# EAGLE schematic HUD (EAGLE 7.3.0)
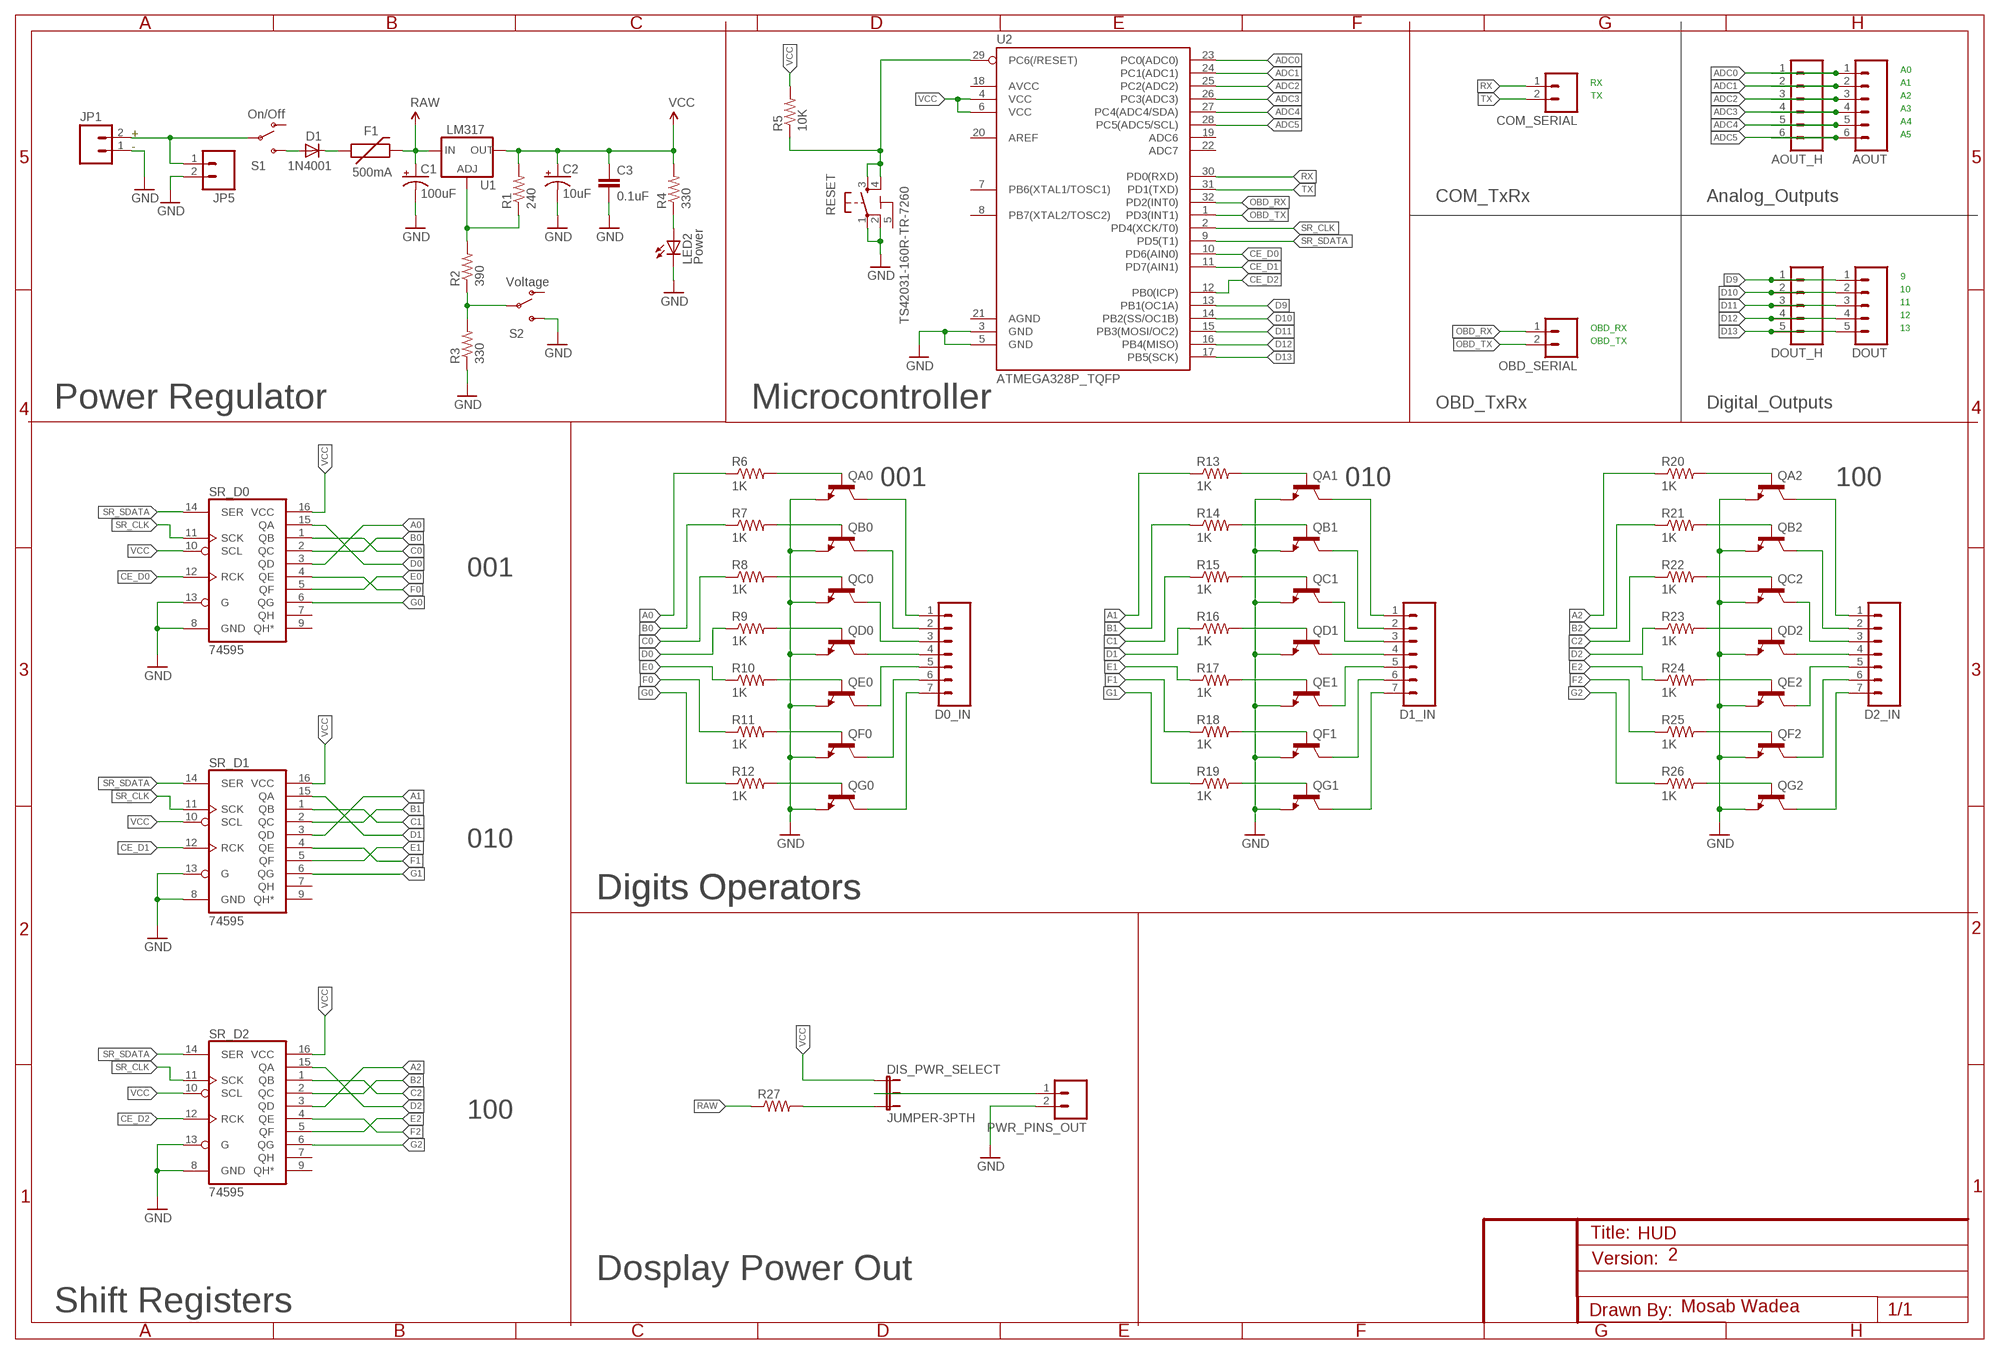
[diagram p0: schematic, sheet 1]

## Parts
AOUT  M06SILK_FEMALE_PTH  [1X06]
AOUT_H  M06SILK_FEMALE_PTH  [1X06]
C1  100uF  CAP_POLPTH1  [CPOL-RADIAL-100UF-25V]
C2  10uF  CAP_POLPTH2  [CPOL-RADIAL-10UF-25V]
C3  0.1uF  CAPPTH2  [CAP-PTH-SMALL2]
COM_SERIAL  M02PTH  [1X02]
D0_IN  M07  [1X07]
D1  1N4001  DIODEPTH  [DIODE-0.4]
D1_IN  M07  [1X07]
D2_IN  M07  [1X07]
DIS_PWR_SELECT  JUMPER-3PTH  [1X03]
DOUT  M05PTH  [1X05]
DOUT_H  M05PTH  [1X05]
F1  500mA  PTCPTH  [PTC]
JP1  M02PTH  [1X02]
JP5  M02PTH  [1X02]
LED2  Power  LED5MM  [LED5MM]
OBD_SERIAL  M02PTH  [1X02]
PWR_PINS_OUT  M02PTH  [1X02]
QA0  TRANSISTOR_NPNP2N2222A  [TO-92]
QA1  TRANSISTOR_NPNP2N2222A  [TO-92]
QA2  TRANSISTOR_NPNP2N2222A  [TO-92]
QB0  TRANSISTOR_NPNP2N2222A  [TO-92]
QB1  TRANSISTOR_NPNP2N2222A  [TO-92]
QB2  TRANSISTOR_NPNP2N2222A  [TO-92]
QC0  TRANSISTOR_NPNP2N2222A  [TO-92]
QC1  TRANSISTOR_NPNP2N2222A  [TO-92]
QC2  TRANSISTOR_NPNP2N2222A  [TO-92]
QD0  TRANSISTOR_NPNP2N2222A  [TO-92]
QD1  TRANSISTOR_NPNP2N2222A  [TO-92]
QD2  TRANSISTOR_NPNP2N2222A  [TO-92]
QE0  TRANSISTOR_NPNP2N2222A  [TO-92]
QE1  TRANSISTOR_NPNP2N2222A  [TO-92]
QE2  TRANSISTOR_NPNP2N2222A  [TO-92]
QF0  TRANSISTOR_NPNP2N2222A  [TO-92]
QF1  TRANSISTOR_NPNP2N2222A  [TO-92]
QF2  TRANSISTOR_NPNP2N2222A  [TO-92]
QG0  TRANSISTOR_NPNP2N2222A  [TO-92]
QG1  TRANSISTOR_NPNP2N2222A  [TO-92]
QG2  TRANSISTOR_NPNP2N2222A  [TO-92]
R1  240  RESISTORPTH1  [AXIAL-0.3]
R2  390  RESISTORPTH1  [AXIAL-0.3]
R3  330  RESISTORPTH1  [AXIAL-0.3]
R4  330  RESISTORPTH1  [AXIAL-0.3]
R5  10K  RESISTORPTH-1/4W  [AXIAL-0.4]
R6  1K  RESISTORPTH-1/4W  [AXIAL-0.4]
R7  1K  RESISTORPTH-1/4W  [AXIAL-0.4]
R8  1K  RESISTORPTH-1/4W  [AXIAL-0.4]
R9  1K  RESISTORPTH-1/4W  [AXIAL-0.4]
R10  1K  RESISTORPTH-1/4W  [AXIAL-0.4]
R11  1K  RESISTORPTH-1/4W  [AXIAL-0.4]
R12  1K  RESISTORPTH-1/4W  [AXIAL-0.4]
R13  1K  RESISTORPTH-1/4W  [AXIAL-0.4]
R14  1K  RESISTORPTH-1/4W  [AXIAL-0.4]
R15  1K  RESISTORPTH-1/4W  [AXIAL-0.4]
R16  1K  RESISTORPTH-1/4W  [AXIAL-0.4]
R17  1K  RESISTORPTH-1/4W  [AXIAL-0.4]
R18  1K  RESISTORPTH-1/4W  [AXIAL-0.4]
R19  1K  RESISTORPTH-1/4W  [AXIAL-0.4]
R20  1K  RESISTORPTH-1/4W  [AXIAL-0.4]
R21  1K  RESISTORPTH-1/4W  [AXIAL-0.4]
R22  1K  RESISTORPTH-1/4W  [AXIAL-0.4]
R23  1K  RESISTORPTH-1/4W  [AXIAL-0.4]
R24  1K  RESISTORPTH-1/4W  [AXIAL-0.4]
R25  1K  RESISTORPTH-1/4W  [AXIAL-0.4]
R26  1K  RESISTORPTH-1/4W  [AXIAL-0.4]
R27  RESISTORPTH-1/4W  [AXIAL-0.4]
RESET  TS42031-160R-TR-7260  TS42  [TS42]
S1  On/Off  SWITCH-SPSTPTH  [SWITCH-SPST]
S2  Voltage  SWITCH-SPSTPTH  [SWITCH-SPST]
SR_D0  74595  [TSSOP16]
SR_D1  74595  [TSSOP16]
SR_D2  74595  [TSSOP16]
U1  LM317  V_REG_317SINK  [TO220-ADJ]
U2  ATMEGA328P_TQFP  [TQFP32-08]

## Nets
12VOUT: DIS_PWR_SELECT.3 R27.P$2
A0: R6.P$1 SR_D0.3(QD)
A1: R13.P$1 SR_D1.3(QD)
A2: R20.P$1 SR_D2.3(QD)
ADC0: AOUT.1 AOUT_H.1 U2.23(PC0(ADC0))
ADC1: AOUT.2 AOUT_H.2 U2.24(PC1(ADC1))
ADC2: AOUT.3 AOUT_H.3 U2.25(PC2(ADC2))
ADC3: AOUT.4 AOUT_H.4 U2.26(PC3(ADC3))
ADC4: AOUT.5 AOUT_H.5 U2.27(PC4(ADC4/SDA))
ADC5: AOUT.6 AOUT_H.6 U2.28(PC5(ADC5/SCL))
B0: R7.P$1 SR_D0.2(QC)
B1: R14.P$1 SR_D1.2(QC)
B2: R21.P$1 SR_D2.2(QC)
C0: R8.P$1 SR_D0.1(QB)
C1: R15.P$1 SR_D1.1(QB)
C2: R22.P$1 SR_D2.1(QB)
CE_D0: SR_D0.12(RCK) U2.10(PD6(AIN0))
CE_D1: SR_D1.12(RCK) U2.11(PD7(AIN1))
CE_D2: SR_D2.12(RCK) U2.12(PB0(ICP))
D0: R9.P$1 SR_D0.15(QA)
D1: R16.P$1 SR_D1.15(QA)
D2: R23.P$1 SR_D2.15(QA)
D9: DOUT.1 DOUT_H.1 U2.13(PB1(OC1A))
D10: DOUT.2 DOUT_H.2 U2.14(PB2(SS/OC1B))
D11: DOUT.3 DOUT_H.3 U2.15(PB3(MOSI/OC2))
D12: DOUT.4 DOUT_H.4 U2.16(PB4(MISO))
D13: DOUT.5 DOUT_H.5 U2.17(PB5(SCK))
DISPLAY_PWR-OUT: DIS_PWR_SELECT.2 PWR_PINS_OUT.1
E0: R10.P$1 SR_D0.5(QF)
E1: R17.P$1 SR_D1.5(QF)
E2: R24.P$1 SR_D2.5(QF)
F0: R11.P$1 SR_D0.4(QE)
F1: R18.P$1 SR_D1.4(QE)
F2: R25.P$1 SR_D2.4(QE)
G0: R12.P$1 SR_D0.6(QG)
G1: R19.P$1 SR_D1.6(QG)
G2: R26.P$1 SR_D2.6(QG)
GND: C1.2(-) C2.2(-) C3.2 JP1.1 JP5.2 LED2.K(C) PWR_PINS_OUT.2 QA0.3(E) QA1.3(E) QA2.3(E) QB0.3(E) QB1.3(E) QB2.3(E) QC0.3(E) QC1.3(E) QC2.3(E) QD0.3(E) QD1.3(E) QD2.3(E) QE0.3(E) QE1.3(E) QE2.3(E) QF0.3(E) QF1.3(E) QF2.3(E) QG0.3(E) QG1.3(E) QG2.3(E) R3.P$1 RESET.1 RESET.2 S2.3(S) SR_D0.8(GND) SR_D0.13(G) SR_D1.8(GND) SR_D1.13(G) SR_D2.8(GND) SR_D2.13(G) U2.3(GND) U2.5(GND)
N$1: D1.C F1.P$1
N$2: D1.A S1.3(S)
N$4: R2.P$1 R3.P$2 S2.2(P)
N$5: R1.P$1 R2.P$2 U1.ADJ
N$6: QA0.2(B) R6.P$2
N$8: LED2.A R4.P$1
N$20: QA1.2(B) R13.P$2
N$21: QC1.2(B) R15.P$2
N$22: QD1.2(B) R16.P$2
N$23: QE1.2(B) R17.P$2
N$24: QF1.2(B) R18.P$2
N$25: QB1.2(B) R14.P$2
N$26: QG1.2(B) R19.P$2
N$27: D1_IN.4 QD1.1(C)
N$28: D1_IN.3 QC1.1(C)
N$29: D1_IN.2 QB1.1(C)
N$30: D1_IN.1 QA1.1(C)
N$31: D1_IN.5 QE1.1(C)
N$32: D1_IN.6 QF1.1(C)
N$33: D1_IN.7 QG1.1(C)
N$34: QC0.2(B) R8.P$2
N$35: QD0.2(B) R9.P$2
N$36: QE0.2(B) R10.P$2
N$37: QF0.2(B) R11.P$2
N$38: QB0.2(B) R7.P$2
N$39: QG0.2(B) R12.P$2
N$40: D0_IN.4 QD0.1(C)
N$41: D0_IN.3 QC0.1(C)
N$42: D0_IN.2 QB0.1(C)
N$43: D0_IN.1 QA0.1(C)
N$44: D0_IN.5 QE0.1(C)
N$45: D0_IN.6 QF0.1(C)
N$46: D0_IN.7 QG0.1(C)
N$47: QA2.2(B) R20.P$2
N$48: QC2.2(B) R22.P$2
N$49: QD2.2(B) R23.P$2
N$50: QE2.2(B) R24.P$2
N$51: QF2.2(B) R25.P$2
N$52: QB2.2(B) R21.P$2
N$53: QG2.2(B) R26.P$2
N$54: D2_IN.4 QD2.1(C)
N$55: D2_IN.3 QC2.1(C)
N$56: D2_IN.2 QB2.1(C)
N$57: D2_IN.1 QA2.1(C)
N$58: D2_IN.5 QE2.1(C)
N$59: D2_IN.6 QF2.1(C)
N$60: D2_IN.7 QG2.1(C)
OBD_RX: OBD_SERIAL.1 U2.32(PD2(INT0))
OBD_TX: OBD_SERIAL.2 U2.1(PD3(INT1))
PWRIN: JP1.2 JP5.1 S1.2(P)
RAW: C1.1(+) F1.P$2 R27.P$1 U1.IN
RESET_WIRE: R5.P$1 RESET.3 RESET.4 U2.29(PC6(/RESET))
RX: COM_SERIAL.1 U2.30(PD0(RXD))
SR_CLK: SR_D0.11(SCK) SR_D1.11(SCK) SR_D2.11(SCK) U2.2(PD4(XCK/T0))
SR_SDATA: SR_D0.14(SER) SR_D1.14(SER) SR_D2.14(SER) U2.9(PD5(T1))
TX: COM_SERIAL.2 U2.31(PD1(TXD))
VCC: C2.1(+) C3.1 DIS_PWR_SELECT.1 R1.P$2 R4.P$2 R5.P$2 SR_D0.10(SCL) SR_D0.16(VCC) SR_D1.10(SCL) SR_D1.16(VCC) SR_D2.10(SCL) SR_D2.16(VCC) U1.OUT U2.4(VCC) U2.6(VCC)
Unconnected: S1.1(O) S2.1(O) SR_D0.7(QH) SR_D0.9(QH*) SR_D1.7(QH) SR_D1.9(QH*) SR_D2.7(QH) SR_D2.9(QH*) U2.7(PB6(XTAL1/TOSC1)) U2.8(PB7(XTAL2/TOSC2)) U2.18(AVCC) U2.19(ADC6) U2.20(AREF) U2.21(AGND) U2.22(ADC7)

## Notes on the sheet
- A0
- RX | A1
- TX | A2
- A3
- A4
- + | A5
- -
- COM_TxRx | Analog_Outputs
- 9
- 10
- 11
- 12
- OBD_RX | 13
- OBD_TX
- Power Regulator | Microcontroller | OBD_TxRx | Digital_Outputs
- 001 | 010 | 100
- 001
- 010
- Digits Operators | Digits Operators
- 100
- 2
- Dosplay Power Out
- Shift Registers | Mosab Wadea

## Power pins joined to a net without a drawn wire
5-GND: RESET.5(5-GND)

## Library data of the parts
AOUT AOUT_H = SparkFun-Connectors:M06: Header 6 Standard 6-pin 0.1" header. Use with straight break away headers (SKU : PRT-00116), right angle break away headers (PRT-00553), swiss pins (PRT-00743), machine pins (PRT-00117), and female headers (PRT-00115). Molex polarized connector foot print use with SKU : PRT-08094 with associated crimp pins and housings. NOTES ON THE VARIANTS LOCK and LOCK_LONGPADS... This footprint was designed to help hold the alignment of a through-hole component (i.e. 6-pin header) while soldering it into place. You may notice that each hole has been shifted either up or down by 0.005 of an inch from it's more standard position (which is a perfectly straight line). This slight alteration caused the pins (the squares in the middle) to touch the edges of the holes. Because they are alternating, it causes a "brace" to hold the component in place. 0.005 has proven to be the perfect amount of "off-center" position when using our standard breakaway headers. Although looks a little odd when you look at the bare footprint, once you have a header in there, the alteration is very hard to notice. Also,if you push a header all the way into place, it is covered up entirely on the bottom side. This idea of altering the position of holes to aid alignment will be further integrated into the Sparkfun Library for other footprints. It can help hold any component with 3 or more connection pins.; PROD_ID: CONN-08437
C1 C2 = SparkFun:CAP_POL: Capacitor Polarized These are standard SMD and PTH capacitors. Normally 10uF, 47uF, and 100uF in electrolytic and tantalum varieties. Always verify the external diameter of the through hole cap, it varies with capacity, voltage, and manufacturer. The EIA devices should be standard.
C3 = SparkFun:CAP: Capacitor Standard 0603 ceramic capacitor, and 0.1" leaded capacitor.
COM_SERIAL JP1 OBD_SERIAL PWR_PINS_OUT = SparkFun-Connectors:M02: Standard 2-pin 0.1" header. Use with - straight break away headers ( PRT-00116) - right angle break away headers (PRT-00553) - swiss pins (PRT-00743) - machine pins (PRT-00117) - female headers (PRT-00115) Molex polarized connector foot print use with: PRT-08233 with associated crimp pins and housings. 2.54_SCREWTERM for use with PRT-10571. 3.5mm Screw Terminal footprints for PRT-08084 5mm Screw Terminal footprints for use with PRT-08432
D0_IN D1_IN D2_IN = SparkFun-Connectors:M07: Header 7 Standard 7-pin 0.1" header. Use with straight break away headers (SKU : PRT-00116), right angle break away headers (PRT-00553), swiss pins (PRT-00743), machine pins (PRT-00117), and female headers (PRT-00115). NOTES ON THE VARIANTS LOCK and LOCK_LONGPADS... This footprint was designed to help hold the alignment of a through-hole component (i.e. 7-pin header) while soldering it into place. You may notice that each hole has been shifted either up or down by 0.005 of an inch from it's more standard position (which is usually a perfectly straight line). This slight alteration caused the pins (the squares in the middle) to touch the edges of the holes. Because they are alternating, it causes a "brace" to hold the header in place. 0.005 has proven to be the perfect amount of "off-center" position when using our standard breakaway headers. Although looks a little odd when you look at the bare footprint, once you have a header in there, the alteration is very hard to notice. Also, if you push a header all the way into place, it is covered up entirely on the bottom side. This idea of altering the position of holes to aid alignment will be further integrated into the Sparkfun Library for other footprints. It can help hold any component with 3 or more connection pins.
D1 = SparkFun:DIODE: Diode These are standard reverse protection diodes and small signal diodes. SMA package can handle up to about 1A. SOD-323 can handle about 200mA. What the SOD-323 package when ordering, there are some mfgs out there that are 5-pin packages.
DIS_PWR_SELECT = SparkFun-Retired:JUMPER-3
DOUT DOUT_H = SparkFun-Connectors:M05: Header 5 Standard 5-pin 0.1" header. Use with straight break away headers (SKU : PRT-00116), right angle break away headers (PRT-00553), swiss pins (PRT-00743), machine pins (PRT-00117), and female headers (PRT-00115). Molex polarized connector foot print use with SKU : PRT-08230 with associated crimp pins and housings.
F1 = SparkFun:PTC: Resettable Fuse PTC Resettable Fuse. Spark Fun Electronics SKU : COM-08357
JP5 = SparkFun:M02: Header 2 Standard 2-pin 0.1" header. Use with straight break away headers (SKU : PRT-00116), right angle break away headers (PRT-00553), swiss pins (PRT-00743), machine pins (PRT-00117), and female headers (PRT-00115). Molex polarized connector foot print use with SKU : PRT-08233 with associated crimp pins and housings.
LED2 = SparkFun-Nate:LED
QA0 QA1 QA2 QB0 QB1 QB2 QC0 QC1 QC2 QD0 QD1 QD2 QE0 QE1 QE2 QF0 QF1 QF2 QG0 QG1 QG2 = SparkFun-DiscreteSemi:TRANSISTOR_NPN: Generic NPN BJT MMBT2222A - TRANS-08049 (SOT-23, 1A 40V) MPSA42 - TRANS-09116 (SOT-23, 500mA 300V) MMBT5088LT1G - TRANS-11160 (SOT-23, 50 mA 30V) BC547 - COM-08928 <http://www.sparkfun.com/products/8928> (TO-92 45V 100mA) (1.Collector 2.Base 3.Emitter) 2N3904 - COM-00521 <http://www.sparkfun.com/products/521> (TO-92 40V 200mA) (1.Emitter 2.Base 3.Collector) P2N2222A - COM-12852 <http://www.sparkfun.com/products/12852> (TO-92 40V 600mA) (1.Collector 2.Base 3.Emitter); PROD_ID: TRANS-09536
R1-R4 = SparkFun:RESISTOR: Resistor
R5-R27 = SparkFun-Resistors:RESISTOR: Resistor
RESET = SmartPrj:TS42: TS42 Dongnan Electronics Tact switch VDC 12V - 50mA
S1 S2 = SparkFun:SWITCH-SPST: SPST Switch Simple slide switch. Spark Fun Electronics SKU : COM-00102
SR_D0 SR_D1 SR_D2 = SparkFun-DigitalIC:74*595: 8-bit SHIFT REGISTER, output latch
U1 = SparkFun:V_REG_317: Voltage Regulator Standard LM317 adjustable voltage regulator. AOI (Adjust Output Input). Google 'LM317 Calculator' for easy to use app to get the two resistor values needed. 240/720 for 5V output. 240/390 for 3.3V output. Spark Fun Electronics SKU : COM-00527
U2 = SparkFun-DigitalIC:ATMEGA328P_TQFP; PROD_ID: IC-09069

## Net classes
0 default: width 0.254 mm, clearance 0.254 mm
2 gnd: width 0.305 mm, drill 0.559 mm, clearance 0.254 mm
3 usbvcc: width 0.508 mm, drill 0.61 mm, clearance 0.254 mm